# Altium schematic sheet Five cell modules.SchDoc
size A4; SheetNumber: 1; SheetTotal: 2
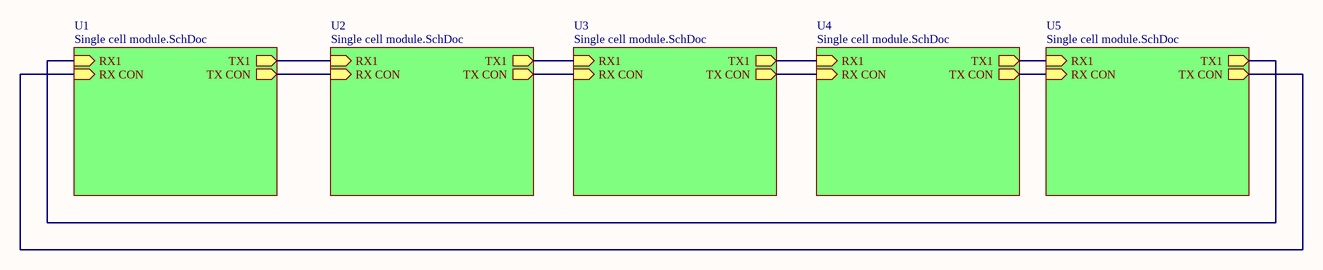
[diagram p0: Five cell modules.SchDoc]

## Sub-sheets
U1 = Single cell module.SchDoc: TX1 (out), TX CON (out), RX1 (in), RX CON (in)
U2 = Single cell module.SchDoc: TX1 (out), TX CON (out), RX1 (in), RX CON (in)
U3 = Single cell module.SchDoc: TX1 (out), TX CON (out), RX1 (in), RX CON (in)
U4 = Single cell module.SchDoc: TX1 (out), TX CON (out), RX1 (in), RX CON (in)
U5 = Single cell module.SchDoc: TX1 (out), TX CON (out), RX1 (in), RX CON (in)

## Nets
(unnamed): sheet U3/TX1, sheet U4/RX1
(unnamed): sheet U3/TX CON, sheet U4/RX CON
(unnamed): sheet U3/RX1, sheet U2/TX1
(unnamed): sheet U3/RX CON, sheet U2/TX CON
(unnamed): sheet U4/TX1, sheet U5/RX1
(unnamed): sheet U4/TX CON, sheet U5/RX CON
(unnamed): sheet U5/TX1, sheet U1/RX1
(unnamed): sheet U5/TX CON, sheet U1/RX CON
(unnamed): sheet U1/TX1, sheet U2/RX1
(unnamed): sheet U1/TX CON, sheet U2/RX CON